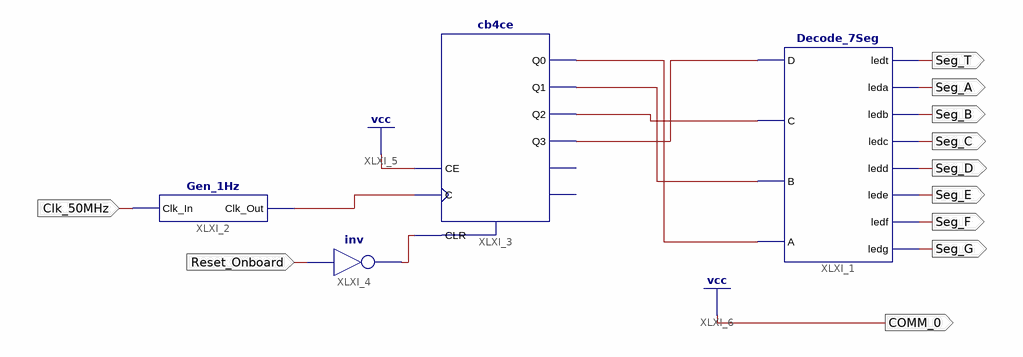
[diagram p0: schematic sheet 1]
// Xilinx ISE schematic werwer.sch (spartan6) as structural Verilog: 4 symbols, 11 ports
module werwer (
  input  Clk_50MHz,
  input  Reset_Onboard,
  output Seg_T,
  output Seg_A,
  output Seg_B,
  output Seg_C,
  output Seg_D,
  output COMM_0,
  output Seg_E,
  output Seg_F,
  output Seg_G
);

  wire XLXN_1, XLXN_2, XLXN_3, XLXN_4, XLXN_5, XLXN_6;

  Decode_7Seg XLXI_1 (
    .D(XLXN_4), .C(XLXN_3), .B(XLXN_2), .A(XLXN_1), .ledt(Seg_T), .leda(Seg_A), .ledb(Seg_B), .ledc(Seg_C),
    .ledd(Seg_D), .lede(Seg_E), .ledf(Seg_F), .ledg(Seg_G));
  Gen_1Hz XLXI_2 (.Clk_In(Clk_50MHz), .Clk_Out(XLXN_5));
  cb4ce XLXI_3 (
    .C(XLXN_5), .CE(1'b1), .CLR(XLXN_6), .Q0(XLXN_1), .Q1(XLXN_2), .Q2(XLXN_3), .Q3(XLXN_4));  // open: CEO, TC
  not XLXI_4 (XLXN_6, Reset_Onboard);

  assign COMM_0 = 1'b1;
endmodule
